# EAGLE design ZB-RC-8_Remote-v01-001 (EAGLE 9.5.1)
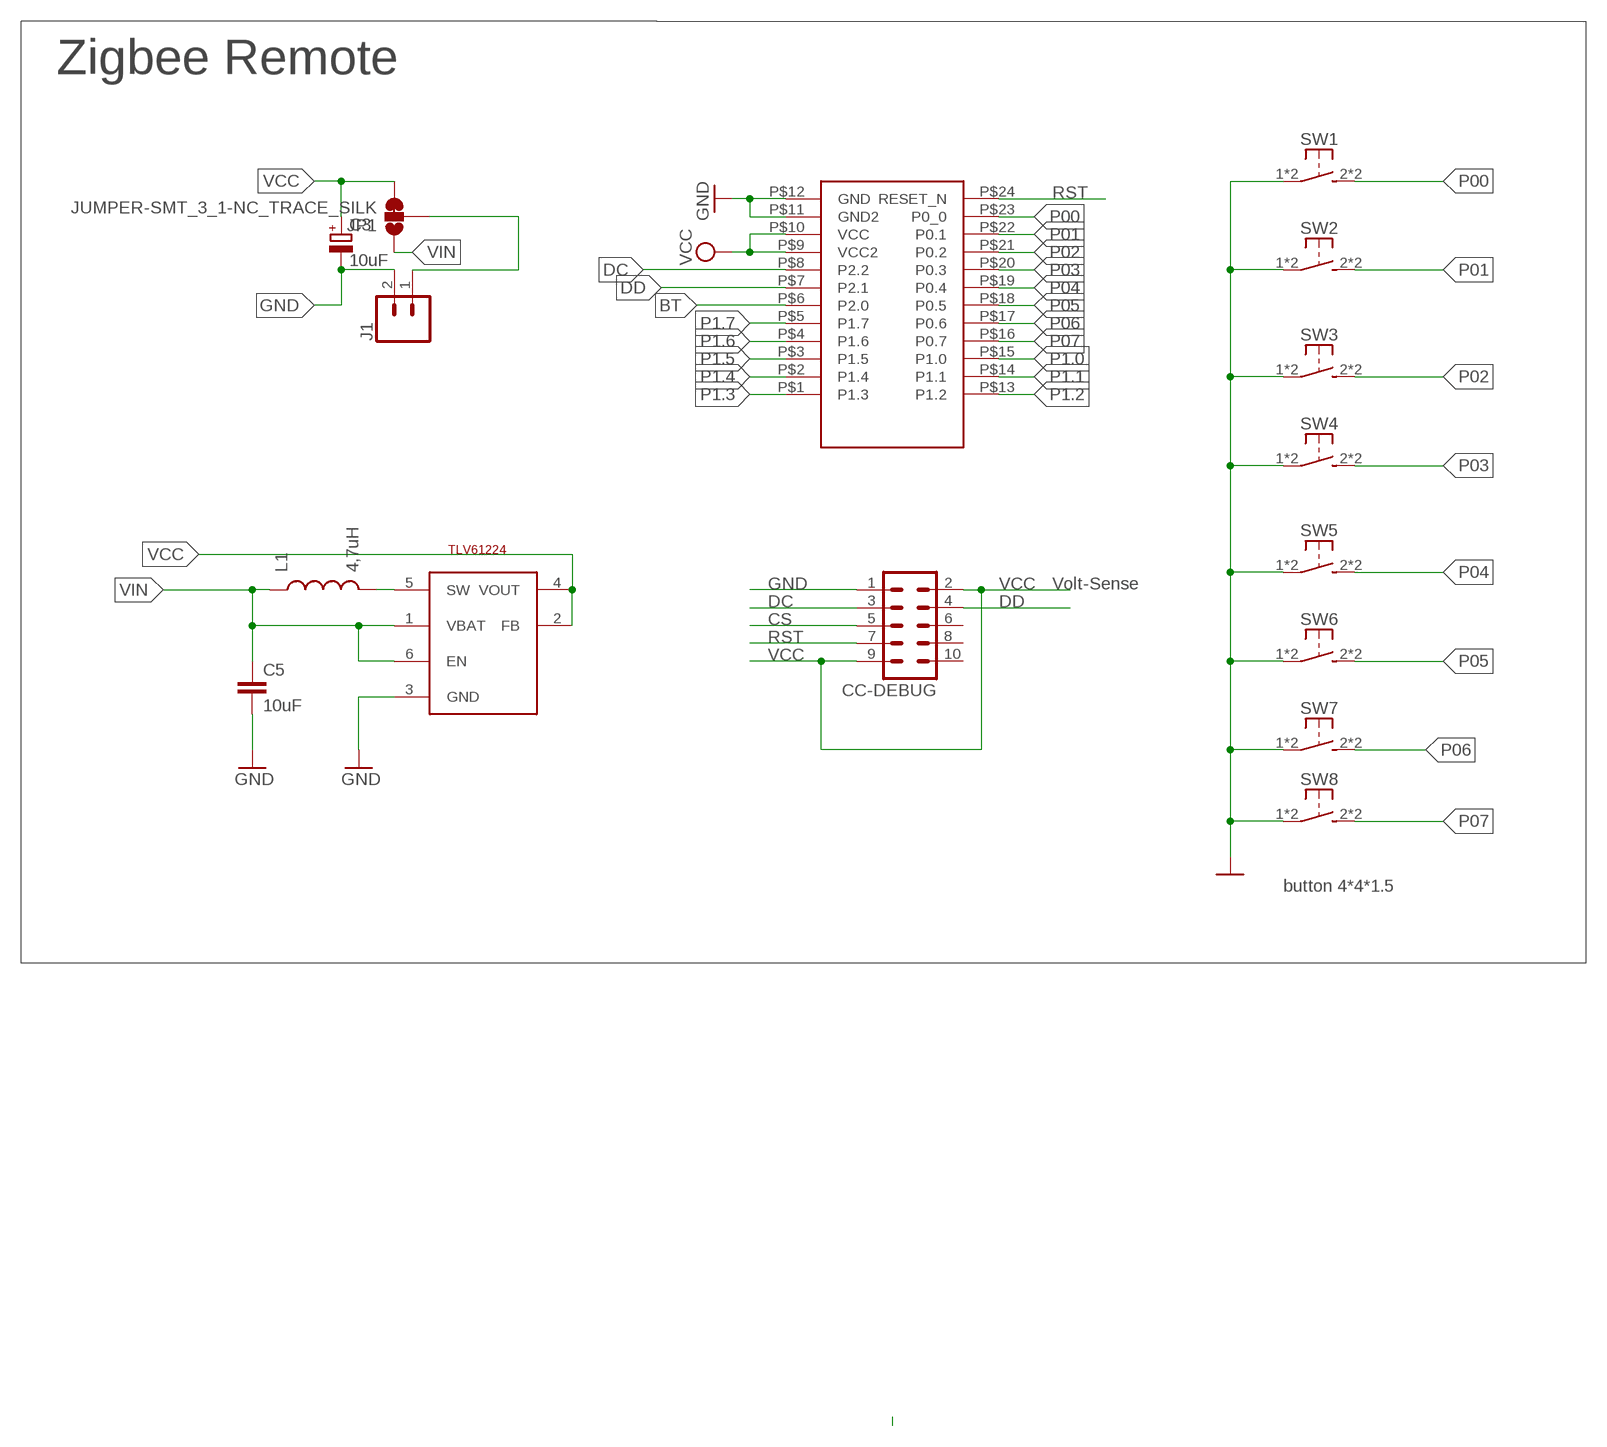
[diagram p0: schematic, sheet 1]

## Parts
C3  10uF  CPOL-EUSMCC  [SMC_C]
C5  10uF  CAP0805  [0805]
CC-DEBUG  MA05-2  [MA05-2]
J1  CONN_02PTH3  [1X02_LONGPADS]
JP1  JUMPER-SMT_3_1-NC_TRACE_SILK  [SMT-JUMPER_3_1-NC_TRACE_SILK]
L1  4,7uH  INDUCTOR0805  [0805]
STEPUP  TLV61224  TI-TLV61224  [SOT23-6L]
SW1  SW-TACTILE-TL3305  [TL3305]
SW2  SW-TACTILE-TL3305  [TL3305]
SW3  SW-TACTILE-TL3305  [TL3305]
SW4  SW-TACTILE-TL3305  [TL3305]
SW5  SW-TACTILE-TL3305  [TL3305]
SW6  SW-TACTILE-TL3305  [TL3305]
SW7  SW-TACTILE-TL3305  [TL3305]
SW8  SW-TACTILE-TL3305  [TL3305]
U$1  CC2530  [SZ1ZIGBEE-SMD]

## Nets
BT: U$1.P$6(P2.0)
CS: CC-DEBUG.5
DC: CC-DEBUG.3 U$1.P$8(P2.2)
DD: CC-DEBUG.4 U$1.P$7(P2.1)
GND [Power]: C3.- C5.2 CC-DEBUG.1 J1.2 STEPUP.3(GND) SW1.1 SW1.4(P1) SW2.1 SW2.4(P1) SW3.1 SW3.4(P1) SW4.1 SW4.4(P1) SW5.1 SW5.4(P1) SW6.1 SW6.4(P1) SW7.1 SW7.4(P1) SW8.1 SW8.4(P1) U$1.P$11(GND2) U$1.P$12(GND)
N$4: J1.1 JP1.2
N$13: L1.2 STEPUP.5(SW)
P00: SW1.2(S1) SW1.3(S1) U$1.P$23(P0_0)
P01: SW2.2(S1) SW2.3(S1) U$1.P$22(P0.1)
P1.0: U$1.P$15(P1.0)
P1.1: U$1.P$14(P1.1)
P1.2: U$1.P$13(P1.2)
P1.3: U$1.P$1(P1.3)
P1.4: U$1.P$2(P1.4)
P1.5: U$1.P$3(P1.5)
P1.6: U$1.P$4(P1.6)
P1.7: U$1.P$5(P1.7)
P02: SW3.2(S1) SW3.3(S1) U$1.P$21(P0.2)
P03: SW4.2(S1) SW4.3(S1) U$1.P$20(P0.3)
P04: SW5.2(S1) SW5.3(S1) U$1.P$19(P0.4)
P05: SW6.2(S1) SW6.3(S1) U$1.P$18(P0.5)
P06: SW7.2(S1) SW7.3(S1) U$1.P$17(P0.6)
P07: SW8.2(S1) SW8.3(S1) U$1.P$16(P0.7)
RST: CC-DEBUG.7 U$1.P$24(RESET_N)
VCC [Power]: C3.+ CC-DEBUG.2 CC-DEBUG.9 JP1.3 STEPUP.2(FB) STEPUP.4(VOUT) U$1.P$9(VCC2) U$1.P$10(VCC)
VIN: C5.1 JP1.1 L1.1 STEPUP.1(VBAT) STEPUP.6(EN)
Unconnected: CC-DEBUG.6 CC-DEBUG.8 CC-DEBUG.10

## Notes on the sheet
- Zigbee Remote
- Volt-Sense
- button 4*4*1.5

## Library data of the parts
C3 = rcl:CPOL-EU: POLARIZED CAPACITOR, European symbol; SPICEPREFIX: C
C5 = SparkFun-Passives:CAP: Capacitor Standard 0603 ceramic capacitor, and 0.1" leaded capacitor.
CC-DEBUG = con-lstb:MA05-2: PIN HEADER; OC_FARNELL: unknown; OC_NEWARK: unknown
J1 = SparkFun-Connectors:CONN_02: Multi connection point. Often used as Generic Header-pin footprint for 0.1 inch spaced/style header connections On any of the 0.1 inch spaced packages, you can populate with these: Break Away Headers - Straight <https://www.sparkfun.com/products/116> (PRT-00116) Break Away Male Headers - Right Angle <https://www.sparkfun.com/products/553> (PRT-00553) Female Headers <https://www.sparkfun.com/products/115> (PRT-00115) Break Away Headers - Machine Pin <https://www.sparkfun.com/products/117> (PRT-00117) Break Away Female Headers - Swiss Machine Pin <https://www.sparkfun.com/products/743> (PRT-00743) For SCREWTERMINALS and SPRING TERMINALS visit here: Screw Terimnals on SparkFun.com <https://www.sparkfun.com/search/results?term=Screw+Terminals> (5mm/3.5mm/2.54mm spacing) This device is also useful as a general connection point to wire up your design to another part of your project. Our various solder wires solder well into these plated through hole pads. Hook-Up Wire - Assortment (Stranded, 22 AWG) <https://www.sparkfun.com/products/11375> (PRT-11375) Hook-Up Wire - Assortment (Solid Core, 22 AWG) <https://www.sparkfun.com/products/11367> (PRT-11367) View the entire wire category on our website here <https://www.sparkfun.com/categories/141> Special notes: Molex polarized connector foot print use with: PRT-08233 with associated crimp pins and housings. 2.54_SCREWTERM for use with PRT-10571. 3.5mm Screw Terminal footprints for PRT-08084 5mm Screw Terminal footprints for use with PRT-08432
JP1 = SparkFun-Jumpers:JUMPER-SMT_3_1-NC_TRACE: Normally closed trace jumper (1 of 2 connections) This jumper has a trace between two pads so it's normally closed (NC). The other connection is normally open (NO). Use a razor knife to open the connection. For best results follow the IPC guidelines for cutting traces: Cutout at least 0.063 mm (0.005 in). Remove all loose material to clean up the cut area. Seal the cut with an approved epoxy. Reapply solder to reclose the connection, or to close the NO connection.
L1 = SparkFun-Passives:INDUCTOR: Inductors Basic Inductor/Choke - 0603 and 1206. Footprints are not proven and vary greatly between part numbers.
STEPUP = TLV61224:TI-TLV61224
SW1-SW8 = we-switch:SW-TACTILE: Tactile Switches
U$1 = zigbee:CC2530: CC2530 Wireless Zigbee Module 3.0-3.6V 2.405-2.485GHz SMD Pads !

## Net classes
0 default: width 0.305 mm
1 Power: width 0.508 mm

## Board
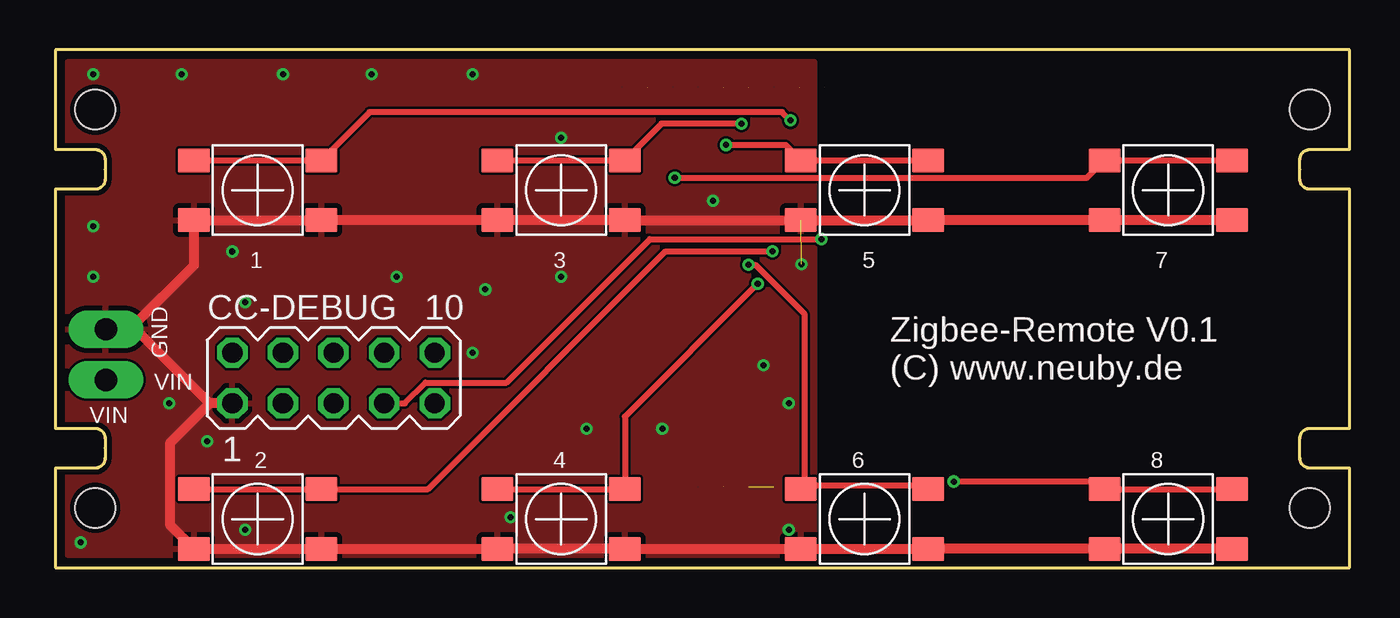
[diagram p1: board, top side]
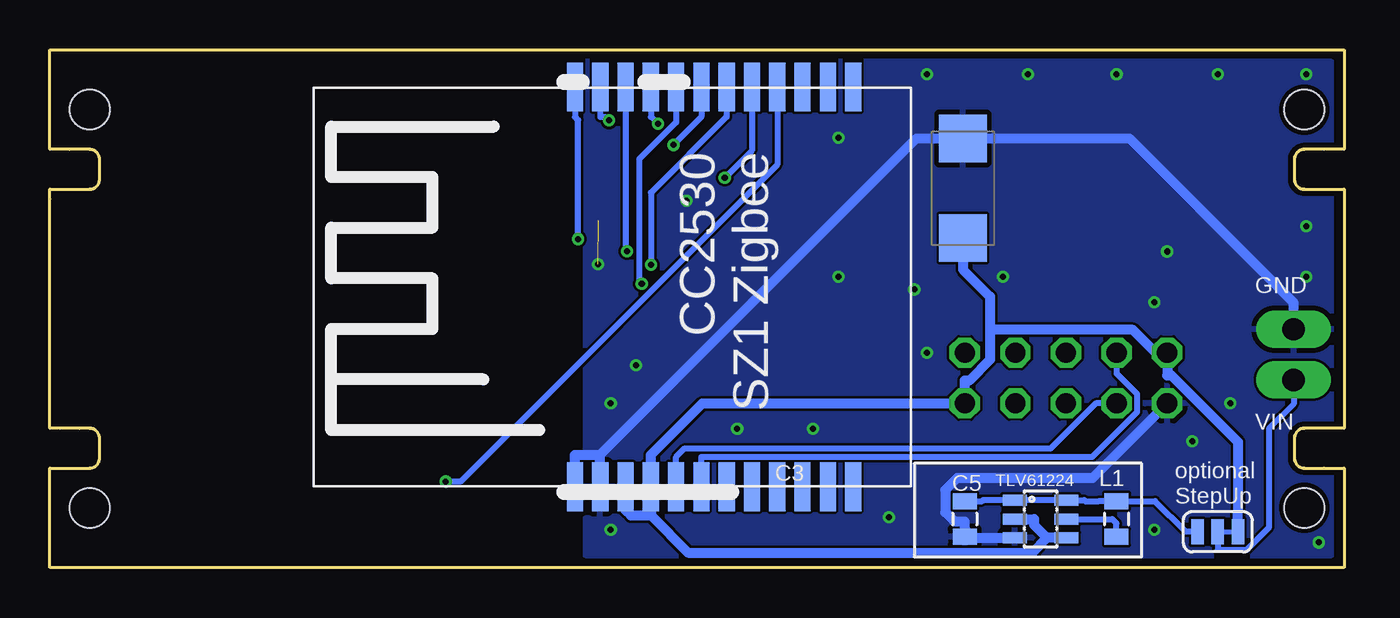
[diagram p2: board, bottom side, seen from below]

Size 65 x 26 mm. Coordinates in mm from the lower left corner, seen from the top.
Outline: 0,0 65,0 65,5 63,5 arc-90 62.5,5.5 62.5,6.5 arc-90 63,7 63.5,7 64.5,7 65,7 65,18.5 65,19 63,19 arc-90 62.5,19.5 62.5,20 62.5,20.5 arc-90 63,21 64,21 65,21 65,26 0,26 0,21 1,21 2,21 arc-90 2.5,20.5 2.5,20 2.5,19.5 arc-90 2,19 0,19 0,7 2,7 arc-90 2.5,6.5 2.5,6 2.5,5.5 arc-90 2,5 1,5 0,5 0,0
Copper layers (1*16): Top 0.035mm / dielectric 1.5mm / Bottom 0.035mm
Design rules "dirt_cheap_dirty_boards.v1": minimum track width 5mil, minimum drill 12mil, track to track 5mil, track to pad 5mil, pad to pad 5mil, via to via 5mil, smd to smd 0mil, copper to edge 10mil, drill to drill 10mil, minimum pad ring 10mil, minimum via ring 6mil, stop-mask expansion 2mil, vias tented up to drill 25mil, thermal gap 10mil
Holes 2 mm at 2,3 2,23 63,23 63,3

### Footprints (pad centres in the part's own frame; a part is rotated, then mirrored left to right if it is on the bottom)
SMC_C = smd 2.4 x 2.4: + -2.5,0; - 2.5,0
0805 = smd 0.8 x 1.2: 1 -0.9,0; 2 0.9,0
MA05-2 = drill 1.016 octagon: 1 -5.08,-1.27; 2 -5.08,1.27; 3 -2.54,-1.27; 4 -2.54,1.27; 5 0,-1.27; 6 0,1.27; 7 2.54,-1.27; 8 2.54,1.27; 9 5.08,-1.27; 10 5.08,1.27
1X02_LONGPADS = drill 1.118 pad 1.88 long: 1 0,0; 2 2.54,0
SMT-JUMPER_3_1-NC_TRACE_SILK = smd 0.635 x 1.27: 1 -1.016,0; 2 0,0; 3 1.016,0
SOT23-6L = smd 0.55 x 1.2: 1 -0.95,-1.3; 2 0,-1.3; 3 0.95,-1.3; 4 0.95,1.3; 5 0,1.3; 6 -0.95,1.3
TL3305 = smd 1.6 x 1.2: 1 -3.2,1.5; 2 -3.2,-1.5; 3 3.2,-1.5; 4 3.2,1.5
SZ1ZIGBEE-SMD = smd 2.438 x 0.813: P$1 -10.036,-12.101; P$2 -10.036,-10.831; P$3 -10.036,-9.561; P$4 -10.036,-8.291; P$5 -10.036,-7.021; P$6 -10.036,-5.751; P$7 -10.036,-4.481; P$8 -10.036,-3.211; P$9 -10.036,-1.941; P$10 -10.036,-0.671; P$11 -10.036,0.599; P$12 -10.036,1.869; P$13 10.03,-12.101; P$14 10.03,-10.831; P$15 10.03,-9.561; P$16 10.03,-8.291; P$17 10.03,-7.021; P$18 10.03,-5.751; P$19 10.03,-4.481; P$20 10.03,-3.211; P$21 10.03,-1.941; P$22 10.03,-0.671; P$23 10.03,0.599; P$24 10.03,1.869

### Placement (x,y rotation side)
C3  19.14,19.05 90 bottom
C5  19.05,2.44 270 bottom
CC-DEBUG  13.97,9.53 0 top
J1  2.54,9.43 90 top
JP1  6.35,1.81 0 bottom
L1  11.43,2.44 270 bottom
STEPUP  15.24,2.44 270 bottom
SW1  10.16,18.95 180 top
SW2  10.16,2.44 180 top
SW3  25.4,18.95 180 top
SW4  25.4,2.44 180 top
SW5  40.64,18.95 180 top
SW6  40.64,2.44 180 top
SW7  55.88,18.95 180 top
SW8  55.88,2.44 180 top
U$1  36.76,14.1 90 bottom

### Tracks (layer width: path | path; a pad name or v marks a point on that pad's centre or on a via)
DC  (1 unrouted)
  Bottom 0.305: CC-DEBUG.3 12.47,8.26 14.73,5.99 33.12,5.99 33.55,5.56 U$1.P$8
DD  (1 unrouted)
  Bottom 0.305: CC-DEBUG.4 11.43,9.75 10.39,8.71 10.39,7.82 12.65,5.56 32.28,5.56 U$1.P$7
GND  (via drill 0.3 pad 0.61)  (2 unrouted)
  Top 0.508: 7.75,8.26 5.78,6.28 5.78,2.13 SW2.4 SW2.1 SW4.4 SW4.1 SW6.4 SW6.1 SW8.4 SW8.1 | 3.89,12.11 6.96,15.18 SW1.4 SW1.1 SW3.4 SW3.1 SW5.4 SW5.1 SW7.4 SW7.1 | 3.89,12.11 3.75,11.97 J1.2 | 3.89,12.11 7.75,8.26 | CC-DEBUG.1 7.75,8.26
  Bottom 0.508: 19.05,1.94 18.61,1.5 STEPUP.3 | 19.05,1.94 19.05,2.33 19.57,2.33 20.03,2.78 20.03,3.91 19.44,4.5 12.64,4.5 CC-DEBUG.1 | C5.2 19.05,1.94 | J1.2 2.54,13.29 10.8,21.55 C3.- 21.47,21.55 37.36,5.66 | 37.36,5.66 38.63,5.66 U$1.P$12 | U$1.P$11 37.36,5.66
  other vias: 1.91,24.77 1.91,17.14 1.91,14.61 1.27,1.27 5.71,8.26 6.35,24.77 11.43,24.77 15.88,24.77 20.95,24.77 25.4,21.59 25.4,14.61 20.95,10.79 21.59,13.97 17.14,14.61 8.89,15.88 9.53,13.34 7.62,6.35 9.53,1.91 22.86,2.54 26.67,6.99 30.48,6.99 35.56,10.16 36.83,1.91 36.83,8.26 37.47,15.24 33.02,18.41
  pour Bottom: 0.64,25.4 38.1,25.4 38.1,0.64 0.64,0.64
  pour Top: 0.64,25.4 38.1,25.4 38.1,0.64 0.64,0.64
N$4
  Bottom 0.305: J1.1 2.54,8.21 3.76,6.99 3.76,2.04 4.9,0.9 6.35,0.9 JP1.2
N$13
  Bottom 0.305: L1.2 11.43,2.22 11.65,2.44 STEPUP.5
P00  (via drill 0.3 pad 0.61)  (1 unrouted)
  Top 0.305: v36.92,22.45 36.5,22.88 15.78,22.88 SW1.2 SW1.3
  Bottom 0.305: U$1.P$23 37.36,22.63 37.1,22.63 v36.92,22.45
P01  (via drill 0.3 pad 0.61)  (1 unrouted)
  Top 0.305: v36.01,15.88 30.64,15.88 18.71,3.94 SW2.2 SW2.3
  Bottom 0.305: U$1.P$22 36.09,15.96 v36.01,15.88
P02  (via drill 0.3 pad 0.61)  (1 unrouted)
  Top 0.305: v34.45,22.29 30.44,22.29 SW3.2 SW3.3
  Bottom 0.305: U$1.P$21 34.82,22.63 34.8,22.63 v34.45,22.29
P03  (via drill 0.3 pad 0.61)  (1 unrouted)
  Top 0.305: v35.27,14.26 28.6,7.59 SW4.2 SW4.3
  Bottom 0.305: U$1.P$20 33.55,22.36 35.4,20.51 35.4,14.39 v35.27,14.26
P04  (via drill 0.3 pad 0.61)  (1 unrouted)
  Top 0.305: SW5.2 SW5.3 36.67,21.22 v33.69,21.22
  Bottom 0.305: v33.69,21.22 32.28,22.63 U$1.P$19
P05  (via drill 0.3 pad 0.61)  (1 unrouted)
  Top 0.305: 37.61,4.11 SW6.3 | SW6.2 43.67,4.11 37.61,4.11 | v34.81,15.2 35.15,15.2 37.61,12.75 37.61,4.11
  Bottom 0.305: U$1.P$18 31.01,22.63 34.81,18.83 v34.81,15.2
P06  (via drill 0.3 pad 0.61)  (1 unrouted)
  Top 0.305: v31.11,19.57 51.8,19.57 SW7.3 SW7.2
  Bottom 0.305: U$1.P$17 29.74,20.94 v31.11,19.57
P07  (via drill 0.3 pad 0.61)  (1 unrouted)
  Top 0.305: v45.11,4.33 52.3,4.33 SW8.3 SW8.2
  Bottom 0.305: U$1.P$16 28.47,20.24 44.38,4.33 v45.11,4.33
RST  (via drill 0.3 pad 0.61)  (1 unrouted)
  Top 0.305: CC-DEBUG.7 17.55,8.26 18.59,9.3 22.65,9.3 29.86,16.5 v38.47,16.5
  Bottom 0.305: U$1.P$24 38.63,22.63 38.47,22.47 v38.47,16.5
VCC  (2 unrouted)
  Bottom 0.508: 34.82,2.62 35.81,2.62 36.09,2.9 U$1.P$10 | 34.82,2.62 32.96,0.76 15.65,0.76 14.92,1.5 | 34.82,2.62 U$1.P$9 34.82,5.66 32.23,8.26 CC-DEBUG.9 19.05,9.4 18.83,9.4 17.78,10.45 17.78,11.94 | STEPUP.2 15.56,2.44 15.56,2.13 14.92,1.5 | STEPUP.4 14.92,1.5 | JP1.3 5.33,2.83 5.33,6.32 8.67,9.65 8.89,9.65 8.89,10.22 | 17.78,11.94 17.78,13.6 19.14,14.97 C3.+ | 8.89,10.22 10.61,11.94 17.78,11.94 | CC-DEBUG.2 8.89,10.22
VIN
  Bottom 0.305: JP1.1 7.96,1.81 9.5,3.35 L1.1 12.31,3.35 13.01,3.35 13.06,3.4 STEPUP.6 STEPUP.1 18.12,3.4 18.17,3.35 C5.1

### Text on the board
tNames: 1 | 3 | 5 | 7 | GND | VIN | Zigbee-Remote V0.1 / (C) www.neuby.de | VIN | 2 | 4 | 6 | 8
bNames: GND | VIN | optional | L1 | TLV61224 | C5 | C3 | StepUp